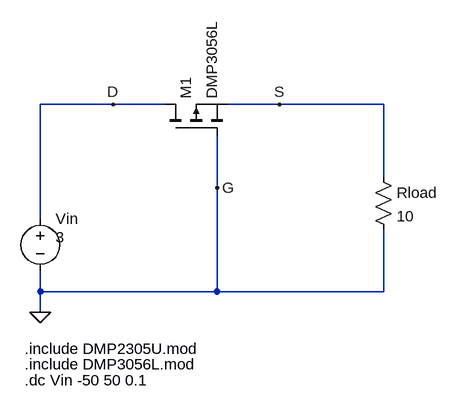
[diagram p0: schematic reverse-polarity.asc]
reverse-polarity.asc, the LTspice schematic file:
Version 4
SHEET 1 2056 680
WIRE 256 -208 144 -208
WIRE 336 -208 256 -208
WIRE 512 -208 432 -208
WIRE 672 -208 512 -208
WIRE 672 -96 672 -208
WIRE 416 -80 416 -160
WIRE 144 -32 144 -208
WIRE 144 80 144 48
WIRE 416 80 416 -80
WIRE 416 80 144 80
WIRE 672 80 672 -16
WIRE 672 80 416 80
WIRE 144 112 144 80
FLAG 144 112 0
FLAG 256 -208 D
FLAG 512 -208 S
FLAG 416 -80 G
SYMBOL pmos 336 -160 R270
SYMATTR InstName M1
SYMATTR Value DMP3056L
SYMATTR Prefix X
SYMBOL voltage 144 -48 R0
WINDOW 3 24 44 Left 2
WINDOW 123 0 0 Left 2
WINDOW 39 0 0 Left 2
SYMATTR Value 3
SYMATTR InstName Vin
SYMBOL res 656 -112 R0
SYMATTR InstName Rload
SYMATTR Value 10
TEXT 120 192 Left 2 !.include DMP3056L.mod
TEXT 120 216 Left 2 !.dc Vin -50 50 0.1
TEXT 120 168 Left 2 !.include DMP2305U.mod

The netlist it stands for:
* reverse-polarity.asc
XM1 D 0 S DMP3056L  ; pins D G S
Vin D 0 3
Rload S 0 10
.include DMP3056L.mod
.dc Vin -50 50 0.1
.include DMP2305U.mod
.backanno
.end